# EAGLE schematic Robot2 (EAGLE 7.6.0)
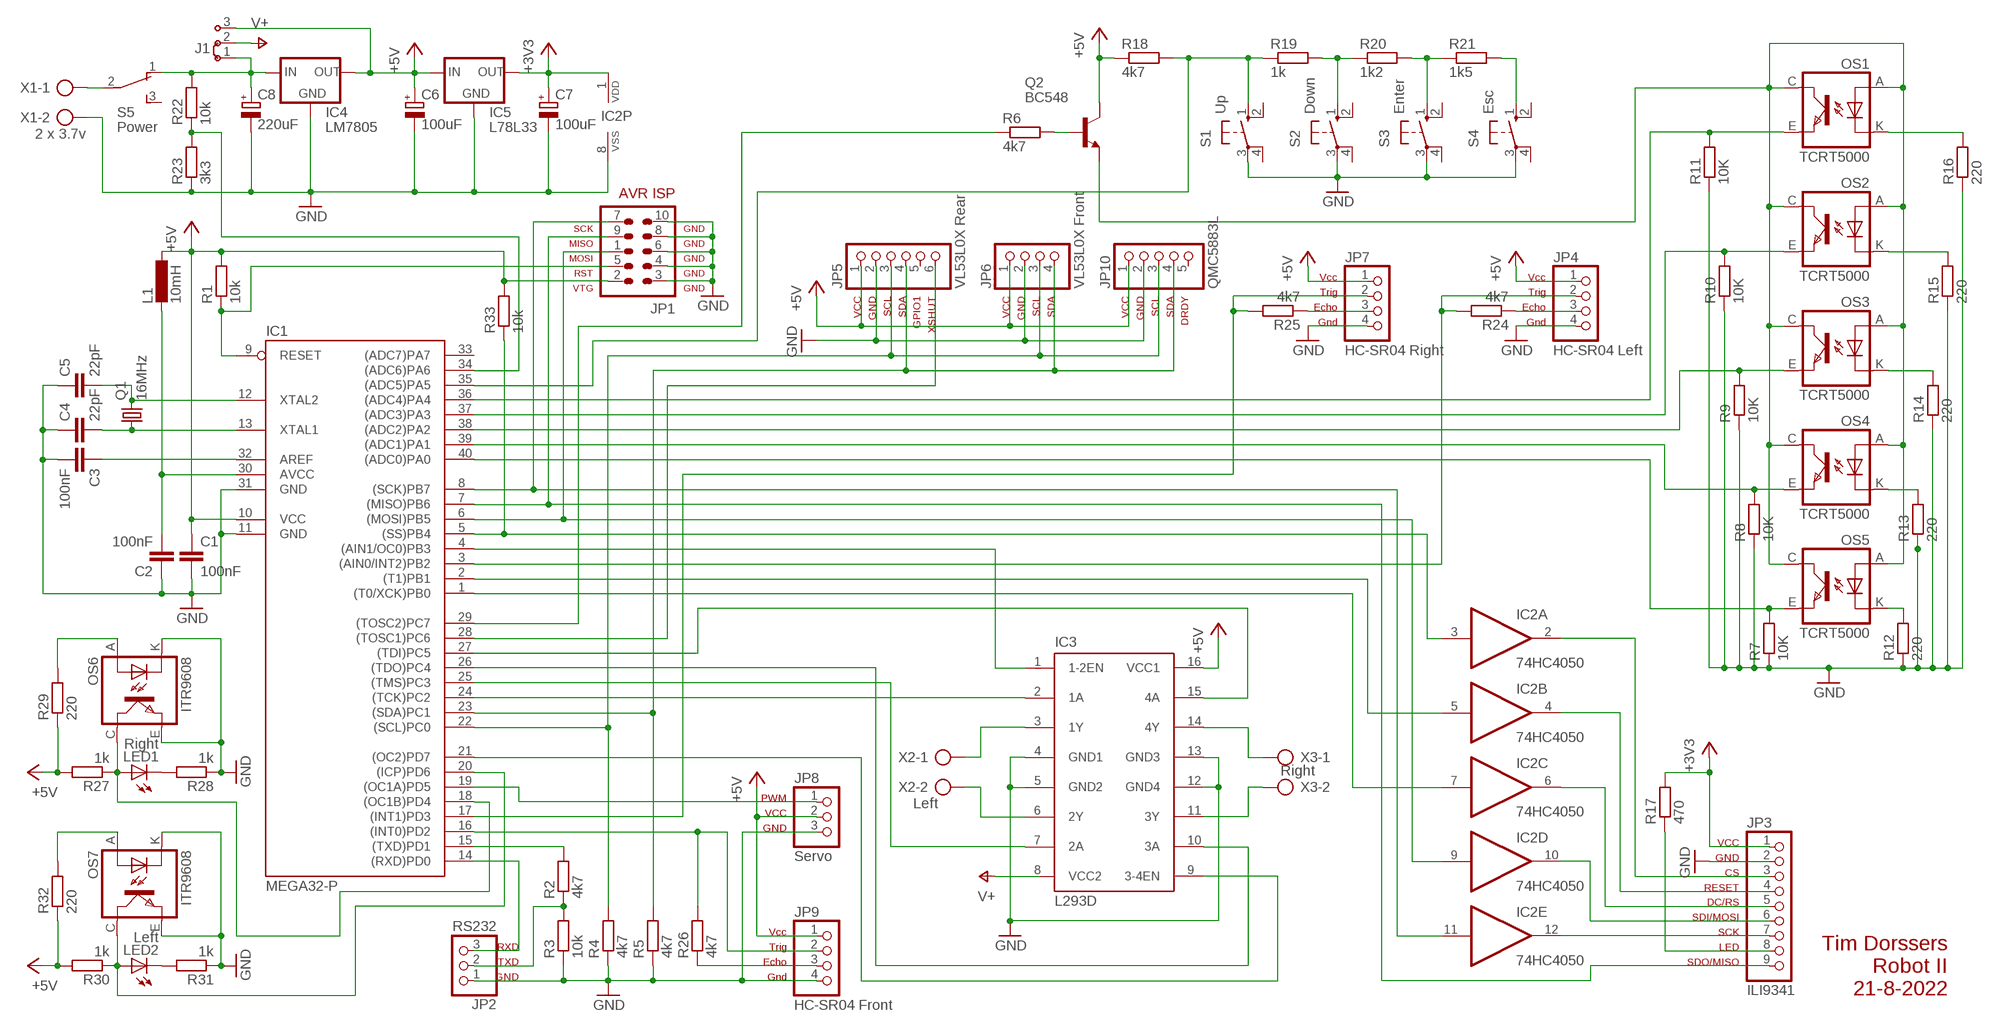
[diagram p0: schematic, sheet 1]

## Parts
C1  100nF  C-EU050-025X075  [C050-025X075]
C2  100nF  C-EU050-025X075  [C050-025X075]
C3  100nF  C-EU050-025X075  [C050-025X075]
C4  22pF  C-EU025-024X044  [C025-024X044]
C5  22pF  C-EU025-024X044  [C025-024X044]
C6  100uF  CPOL-EUB45181A  [B45181A]
C7  100uF  CPOL-EUB45181A  [B45181A]
C8  220uF  CPOL-EUB45181A  [B45181A]
IC1  MEGA32-P  [DIL40]
IC2  74HC4050  4050N  [DIL16]
IC3  L293D  [DIL16]
IC4  LM7805  78XXL  [78XXL]
IC5  L78L33  78LXX  [78LXX]
J1  J2X2MM  [04C]
JP1  AVR-ISP-10  [AVR-ISP-10]
JP2  RS232  PINHD-1X3  [1X03]
JP3  ILI9341  PINHD-1X9  [1X09]
JP4  HC-SR04 Left  PINHD-1X4  [1X04]
JP5  VL53L0X Rear  PINHD-1X6  [1X06]
JP6  VL53L0X Front  PINHD-1X4  [1X04]
JP7  HC-SR04 Right  PINHD-1X4  [1X04]
JP8  Servo  PINHD-1X3  [1X03]
JP9  HC-SR04 Front  PINHD-1X4  [1X04]
JP10  QMC5883L  PINHD-1X5  [1X05]
L1  10mH  L-EU0207/10  [0207/10]
LED1  Right  LED5MM  [LED5MM]
LED2  Left  LED5MM  [LED5MM]
OS1  TCRT5000  [TCRT5000]
OS2  TCRT5000  [TCRT5000]
OS3  TCRT5000  [TCRT5000]
OS4  TCRT5000  [TCRT5000]
OS5  TCRT5000  [TCRT5000]
OS6  ITR9608  TCRT5000  [TCRT5000]
OS7  ITR9608  TCRT5000  [TCRT5000]
Q1  16MHz  CRYSTALHC49U-V  [HC49U-V]
Q2  BC548  [TO92-EBC]
R1  10k  R-EU_0207/2V  [0207/2V]
R2  4k7  R-EU_0207/2V  [0207/2V]
R3  10k  R-EU_0207/2V  [0207/2V]
R4  4k7  R-EU_0207/2V  [0207/2V]
R5  4k7  R-EU_0207/2V  [0207/2V]
R6  4k7  R-EU_0207/2V  [0207/2V]
R7  10K  R-EU_0204/7  [0204/7]
R8  10K  R-EU_0204/7  [0204/7]
R9  10K  R-EU_0204/7  [0204/7]
R10  10K  R-EU_0204/7  [0204/7]
R11  10K  R-EU_0204/7  [0204/7]
R12  220  R-EU_0204/7  [0204/7]
R13  220  R-EU_0204/7  [0204/7]
R14  220  R-EU_0204/7  [0204/7]
R15  220  R-EU_0204/7  [0204/7]
R16  220  R-EU_0204/7  [0204/7]
R17  470  R-EU_0207/2V  [0207/2V]
R18  4k7  R-EU_0207/2V  [0207/2V]
R19  1k  R-EU_0207/2V  [0207/2V]
R20  1k2  R-EU_0207/2V  [0207/2V]
R21  1k5  R-EU_0207/2V  [0207/2V]
R22  10k  R-EU_0207/2V  [0207/2V]
R23  3k3  R-EU_0207/2V  [0207/2V]
R24  4k7  R-EU_0207/2V  [0207/2V]
R25  4k7  R-EU_0207/2V  [0207/2V]
R26  4k7  R-EU_0207/2V  [0207/2V]
R27  1k  R-EU_0207/2V  [0207/2V]
R28  1k  R-EU_0207/2V  [0207/2V]
R29  220  R-EU_0207/2V  [0207/2V]
R30  1k  R-EU_0207/2V  [0207/2V]
R31  1k  R-EU_0207/2V  [0207/2V]
R32  220  R-EU_0207/2V  [0207/2V]
R33  10k  R-EU_0207/2V  [0207/2V]
S1  Up  10-XX  [B3F-10XX]
S2  Down  10-XX  [B3F-10XX]
S3  Enter  10-XX  [B3F-10XX]
S4  Esc  10-XX  [B3F-10XX]
S5  Power  TL36PO  [TL3XPO]
X1  2 x 3.7v  AK300/2  [AK300/2]
X2  Left  AK300/2  [AK300/2]
X3  Right  AK300/2  [AK300/2]

## Nets
+3V3: C7.+ IC2.1(P:VDD) IC5.OUT JP3.1 R17.2
+5V: C1.1 C6.+ IC1.10(VCC) IC3.16(VCC1) IC4.OUT IC5.IN J1.3 JP1.2 JP4.1 JP5.1 JP6.1 JP7.1 JP8.2 JP9.1 JP10.1 L1.1 Q2.C R1.2 R18.1 R27.2 R29.1 R30.2 R32.1 R33.2
GND: C1.2 C2.1 C3.2 C4.1 C5.1 C6.- C7.- C8.- IC1.11(GND) IC1.31(GND) IC2.8(P:VSS) IC3.4(GND1) IC3.5(GND2) IC3.12(GND4) IC3.13(GND3) IC4.GND IC5.GND JP1.3 JP1.4 JP1.6 JP1.8 JP1.10 JP2.1 JP3.2 JP4.4 JP5.2 JP6.2 JP7.4 JP8.3 JP9.4 JP10.2 OS6.E(EMITTER) OS6.K(CATHODE) OS7.E(EMITTER) OS7.K(CATHODE) R3.1 R4.1 R5.1 R7.1 R8.1 R9.1 R10.1 R11.1 R12.1 R13.1 R14.1 R15.1 R16.1 R23.1 R28.1 R31.1 S1.3(P) S2.3(P) S3.3(P) S4.3(P) X1.2
N$1: C5.2 IC1.12(XTAL2) Q1.2
N$2: C4.2 IC1.13(XTAL1) Q1.1
N$3: JP2.2 R2.1 R3.2
N$4: IC1.29((TOSC2)PC7) R6.1
N$5: C2.2 IC1.30(AVCC) L1.2
N$6: IC1.15((TXD)PD1) R2.2
N$7: C3.1 IC1.32(AREF)
N$8: IC1.14((RXD)PD0) JP2.3
N$9: IC1.3((AIN0/INT2)PB2) JP4.2 R24.2
N$10: IC1.22((SCL)PC0) JP5.3 JP6.3 JP10.3 R4.2
N$11: IC1.23((SDA)PC1) JP5.4 JP6.4 JP10.4 R5.2
N$12: JP3.8 R17.1
N$13: Q2.B R6.2
N$14: IC1.8((SCK)PB7) IC2.11(E:I) JP1.7
N$15: IC1.7((MISO)PB6) JP1.9 JP3.9
N$16: IC1.6((MOSI)PB5) IC2.9(D:I) JP1.1
N$17: IC1.9(RESET) JP1.5 R1.1
N$18: IC1.36((ADC4)PA4) OS1.E(EMITTER) R11.2
N$19: IC1.37((ADC3)PA3) OS2.E(EMITTER) R10.2
N$20: IC1.38((ADC2)PA2) OS3.E(EMITTER) R9.2
N$21: IC1.39((ADC1)PA1) OS4.E(EMITTER) R8.2
N$22: IC1.40((ADC0)PA0) OS5.E(EMITTER) R7.2
N$23: OS5.K(CATHODE) R12.2
N$24: OS1.K(CATHODE) R16.2
N$25: OS2.K(CATHODE) R15.2
N$26: OS3.K(CATHODE) R14.2
N$27: OS4.K(CATHODE) R13.2
N$28: JP4.3 R24.1
N$29: S5.2(P) X1.1
N$30: IC2.6(C:O) JP3.5
N$31: IC2.2(A:O) JP3.3
N$32: IC2.10(D:O) JP3.6
N$33: IC1.34((ADC6)PA6) R22.1 R23.2
N$34: IC2.4(B:O) JP3.4
N$35: IC3.3(1Y) X2.1
N$36: IC2.12(E:O) JP3.7
N$37: IC1.5((SS)PB4) IC2.3(A:I) R33.1
N$38: IC1.35((ADC5)PA5) R18.2 R19.1 S1.1(S)
N$39: R19.2 R20.1 S2.1(S)
N$40: R20.2 R21.1 S3.1(S)
N$41: R21.2 S4.1(S)
N$42: IC1.2((T1)PB1) IC2.5(B:I)
N$43: IC1.1((T0/XCK)PB0) IC2.7(C:I)
N$44: IC1.4((AIN1/OC0)PB3) IC3.1(1-2EN)
N$45: IC1.21((OC2)PD7) IC3.9(3-4EN)
N$47: IC1.16((INT0)PD2) JP9.2 R26.2
N$48: IC3.6(2Y) X2.2
N$49: IC1.24((TCK)PC2) IC3.2(1A)
N$50: OS1.A(ANODE) OS1.C(COLLECTOR) OS2.A(ANODE) OS2.C(COLLECTOR) OS3.A(ANODE) OS3.C(COLLECTOR) OS4.A(ANODE) OS4.C(COLLECTOR) OS5.A(ANODE) OS5.C(COLLECTOR) Q2.E
N$51: IC1.26((TDO)PC4) IC3.10(3A)
N$52: IC1.17((INT1)PD3) JP7.2 R25.2
N$53: IC1.25((TMS)PC3) IC3.7(2A)
N$54: IC1.27((TDI)PC5) IC3.15(4A)
N$55: IC3.14(4Y) X3.1
N$56: IC3.11(3Y) X3.2
N$57: IC1.28((TOSC1)PC6) JP5.6
N$58: JP7.3 R25.1
N$59: C8.+ IC4.IN J1.1 R22.2 S5.1(O)
N$60: JP9.3 R26.1
N$62: IC1.19((OC1A)PD5) JP8.1
N$63: IC1.20((ICP)PD6) LED2.A OS7.C(COLLECTOR) R30.1
N$66: IC1.18((OC1B)PD4) LED1.A OS6.C(COLLECTOR) R27.1
N$67: LED2.K(C) R31.2
N$68: OS6.A(ANODE) R29.2
N$69: LED1.K(C) R28.2
N$70: OS7.A(ANODE) R32.2
V+: J1.2
Unconnected: IC1.33((ADC7)PA7) IC2.14(F:I) IC2.15(F:O) JP5.5 JP10.5 S1.2(S1) S1.4(P1) S2.2(S1) S2.4(P1) S3.2(S1) S3.4(P1) S4.2(S1) S4.4(P1) S5.3(S)

## Notes on the sheet
- VCC
  GND
  SCL
  SDA
  GPIO1
  XSHUT
- VCC
  GND
  SCL
  SDA
- VCC
  GND
  SCL
  SDA
  DRDY
- Vcc
  Trig
  Echo
  Gnd
- Vcc
  Trig
  Echo
  Gnd
- PWM
  VCC
  GND
- VCC
  GND
  CS
  RESET
  DC/RS
  SDI/MOSI
  SCK
  LED
  SDO/MISO
- RXD
  TXD
  GND
- Vcc
  Trig
  Echo
  Gnd
- Tim Dorssers
  Robot II
  21-8-2022

## Power pins joined to a net without a drawn wire
VCC2: IC3.8(VCC2)

## Library data of the parts
C1-C5 = rcl:C-EU: CAPACITOR, European symbol
C6-C8 = rcl:CPOL-EU: POLARIZED CAPACITOR, European symbol
IC1 = atmel:MEGA32-P: MICROCONTROLLER 32 Kbytes FLASH 2 Kbytes SRAM 1 Kbytes EEPROM USART 8-channel 10 bit ADC Source: www.atmel.com .. doc2503.pdf; MPN: ATMEGA32-16PU; OC_FARNELL: 1661729; OC_NEWARK: 51P1794
IC2 = 40xx:4050: Hex non-inverting BUFFER
IC3 = st-microelectronics:L293D: PUSH-PULL 4 CHANNEL DRIVER; MPN: L293D; OC_FARNELL: 9589619; OC_NEWARK: 56P8249
IC4 = v-reg:78XXL: VOLTAGE REGULATOR
IC5 = v-reg:78LXX: VOLTAGE REGULATOR
J1 = jumper:J2: Jumper switch 2 x 2.5 mm
JP1 = avr-7:AVR-ISP-10: AVR ISP-10 Serial Programming Header
JP2 JP8 = pinhead:PINHD-1X3: PIN HEADER
JP3 = pinhead:PINHD-1X9: PIN HEADER
JP4 JP6 JP7 JP9 = pinhead:PINHD-1X4: PIN HEADER
JP5 = pinhead:PINHD-1X6: PIN HEADER
JP10 = pinhead:PINHD-1X5: PIN HEADER
L1 = rcl:L-EU: INDUCTOR, European symbol
LED1 LED2 = led:LED: LED OSRAM: - CHIPLED LG R971, LG N971, LY N971, LG Q971, LY Q971, LO R971, LY R971 LH N974, LH R974 LS Q976, LO Q976, LY Q976 LO Q996 - Hyper CHIPLED LW Q18S LB Q993, LB Q99A, LB R99A - SideLED LS A670, LO A670, LY A670, LG A670, LP A670 LB A673, LV A673, LT A673, LW A673 LH A674 LY A675 LS A676, LA A676, LO A676, LY A676, LW A676 LS A679, LY A679, LG A679 - Hyper Micro SIDELED® LS Y876, LA Y876, LO Y876, LY Y876 LT Y87S - SmartLED LW L88C, LW L88S LB L89C, LB L89S, LG L890 LS L89K, LO L89K, LY L89K LS L896, LA L896, LO L896, LY L896 - TOPLED LS T670, LO T670, LY T670, LG T670, LP T670 LSG T670, LSP T670, LSY T670, LOP T670, LYG T670 LG T671, LOG T671, LSG T671 LB T673, LV T673, LT T673, LW T673 LH T674 LS T676, LA T676, LO T676, LY T676, LB T676, LH T676, LSB T676, LW T676 LB T67C, LV T67C, LT T67C, LS T67K, LO T67K, LY T67K, LW E67C LS E67B, LA E67B, LO E67B, LY E67B, LB E67C, LV E67C, LT E67C LW T67C LS T679, LY T679, LG T679 LS T770, LO T770, LY T770, LG T770, LP T770 LB T773, LV T773, LT T773, LW T773 LH T774 LS E675, LA E675, LY E675, LS T675 LS T776, LA T776, LO T776, LY T776, LB T776 LHGB T686 LT T68C, LB T68C - Hyper Mini TOPLED® LB M676 - Mini TOPLED Santana® LG M470 LS M47K, LO M47K, LY M47K Source: http://www.osram.convergy.de LUXEON: - LUMILED® LXK2-PW12-R00, LXK2-PW12-S00, LXK2-PW14-U00, LXK2-PW14-V00 LXK2-PM12-R00, LXK2-PM12-S00, LXK2-PM14-U00 LXK2-PE12-Q00, LXK2-PE12-R00, LXK2-PE12-S00, LXK2-PE14-T00, LXK2-PE14-U00 LXK2-PB12-K00, LXK2-PB12-L00, LXK2-PB12-M00, LXK2-PB14-N00, LXK2-PB14-P00, LXK2-PB14-Q00 LXK2-PR12-L00, LXK2-PR12-M00, LXK2-PR14-Q00, LXK2-PR14-R00 LXK2-PD12-Q00, LXK2-PD12-R00, LXK2-PD12-S00 LXK2-PH12-R00, LXK2-PH12-S00 LXK2-PL12-P00, LXK2-PL12-Q00, LXK2-PL12-R00 Source: www.luxeon.com KINGBRIGHT: KA-3528ASYC Source: www.kingbright.com
OS1-OS7 = tcrt5000:TCRT5000
Q1 = crystal:CRYSTAL: CRYSTAL; OC_FARNELL: 1666969; OC_NEWARK: unknown
Q2 = transistor-npn:BC548*: NPN Transistor
R1-R6 R17-R33 = rcl:R-EU_: RESISTOR, European symbol
R7-R16 = resistor:R-EU_: RESISTOR, European symbol
S1-S4 = switch-omron:10-XX: OMRON SWITCH; MPN: B3F-1000; OC_FARNELL: 176432; OC_NEWARK: 36M3542
S5 = switch:TL36PO: TINY SWITCH ON - ON Source: http://www2.produktinfo.conrad.com/datenblaetter/700000-724999/705152-da-01-de-Subminiaturschalter_TL_36YO.pdf
X1-X3 = con-ptr500:AK300/2: CONNECTOR